# EAGLE design 74595 (EAGLE 9.6.2)
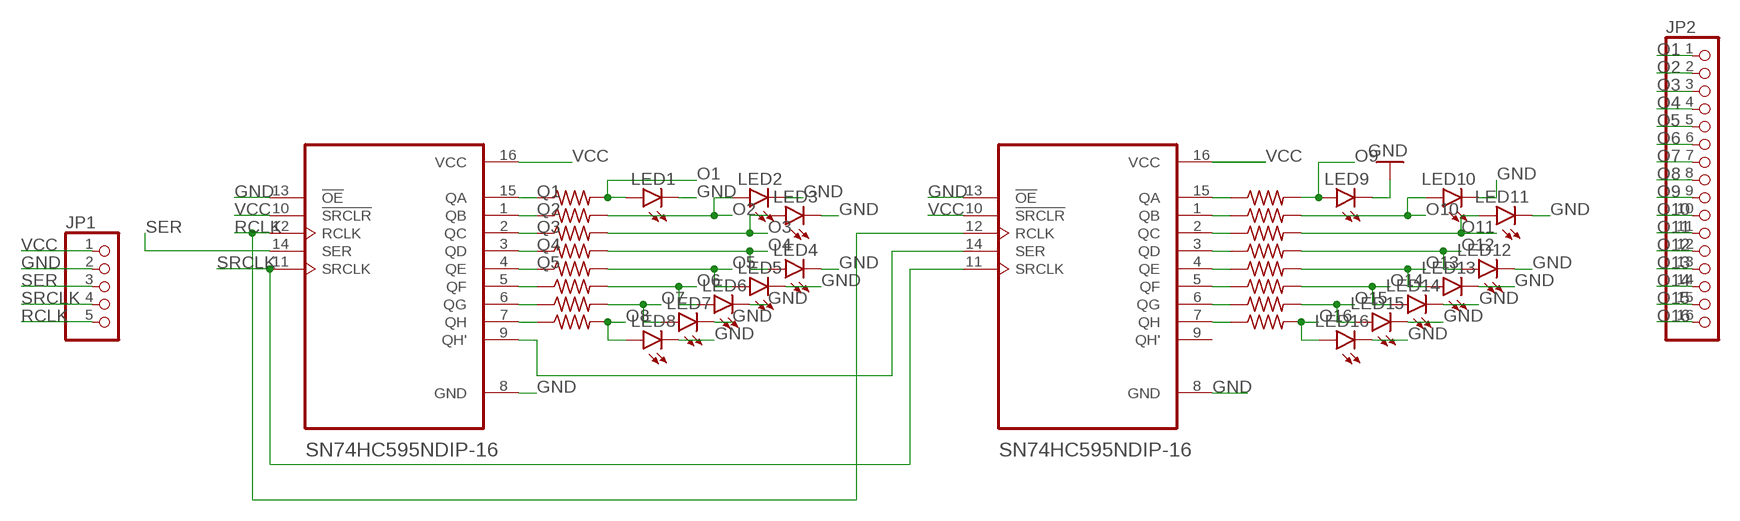
[diagram p0: schematic, sheet 1]

## Parts
JP1  PINHD-1X5  [1X05]
JP2  PINHD-1X16  [1X16]
LED1  LEDCHIPLED_0805  [CHIPLED_0805]
LED2  LEDCHIPLED_0805  [CHIPLED_0805]
LED3  LEDCHIPLED_0805  [CHIPLED_0805]
LED4  LEDCHIPLED_0805  [CHIPLED_0805]
LED5  LEDCHIPLED_0805  [CHIPLED_0805]
LED6  LEDCHIPLED_0805  [CHIPLED_0805]
LED7  LEDCHIPLED_0805  [CHIPLED_0805]
LED8  LEDCHIPLED_0805  [CHIPLED_0805]
LED9  LEDCHIPLED_0805  [CHIPLED_0805]
LED10  LEDCHIPLED_0805  [CHIPLED_0805]
LED11  LEDCHIPLED_0805  [CHIPLED_0805]
LED12  LEDCHIPLED_0805  [CHIPLED_0805]
LED13  LEDCHIPLED_0805  [CHIPLED_0805]
LED14  LEDCHIPLED_0805  [CHIPLED_0805]
LED15  LEDCHIPLED_0805  [CHIPLED_0805]
LED16  LEDCHIPLED_0805  [CHIPLED_0805]
R1  R-US_R0805  [R0805]
R2  R-US_R0805  [R0805]
R3  R-US_R0805  [R0805]
R4  R-US_R0805  [R0805]
R5  R-US_R0805  [R0805]
R6  R-US_R0805  [R0805]
R7  R-US_R0805  [R0805]
R8  R-US_R0805  [R0805]
R9  R-US_R0805  [R0805]
R10  R-US_R0805  [R0805]
R11  R-US_R0805  [R0805]
R12  R-US_R0805  [R0805]
R13  R-US_R0805  [R0805]
R14  R-US_R0805  [R0805]
R15  R-US_R0805  [R0805]
R16  R-US_R0805  [R0805]
U1  SN74HC595NDIP-16  [DIP794W45P254L1969H508Q16]
U2  SN74HC595NDIP-16  [DIP794W45P254L1969H508Q16]

## Nets
GND: JP1.2 LED1.C LED2.C LED3.C LED4.C LED5.C LED6.C LED7.C LED8.C LED9.C LED10.C LED11.C LED12.C LED13.C LED14.C LED15.C LED16.C U1.8(GND) U1.13(!OE) U2.8(GND) U2.13(!OE)
N$9: U1.9(QH') U2.14(SER)
O1: JP2.1 LED1.A R1.2
O2: JP2.2 LED2.A R2.2
O3: JP2.3 LED3.A R3.2
O4: JP2.4 LED4.A R4.2
O5: JP2.5 LED5.A R5.2
O6: JP2.6 LED6.A R6.2
O7: JP2.7 LED7.A R8.2
O8: JP2.8 LED8.A R9.2
O9: JP2.9 LED9.A R7.2
O10: JP2.10 LED10.A R10.2
O11: JP2.11 LED11.A R11.2
O12: JP2.12 LED12.A R12.2
O13: JP2.13 LED13.A R13.2
O14: JP2.14 LED14.A R14.2
O15: JP2.15 LED15.A R15.2
O16: JP2.16 LED16.A R16.2
Q1: R1.1 U1.15(QA)
Q2: R2.1 U1.1(QB)
Q3: R3.1 U1.2(QC)
Q4: R4.1 U1.3(QD)
Q5: R5.1 U1.4(QE)
Q6: R6.1 U1.5(QF)
Q7: R8.1 U1.6(QG)
Q8: R9.1 U1.7(QH)
Q9: R7.1 U2.15(QA)
Q10: R10.1 U2.1(QB)
Q11: R11.1 U2.2(QC)
Q12: R12.1 U2.3(QD)
Q13: R13.1 U2.4(QE)
Q14: R14.1 U2.5(QF)
Q15: R15.1 U2.6(QG)
Q16: R16.1 U2.7(QH)
RCLK: JP1.5 U1.12(RCLK) U2.12(RCLK)
SER: JP1.3 U1.14(SER)
SRCLK: JP1.4 U1.11(SRCLK) U2.11(SRCLK)
VCC: JP1.1 U1.10(!SRCLR) U1.16(VCC) U2.10(!SRCLR) U2.16(VCC)
Unconnected: U2.9(QH')

## Library data of the parts
JP1 = pinhead:PINHD-1X5: PIN HEADER
JP2 = pinhead:PINHD-1X16: PIN HEADER
LED1-LED16 = led:LED: LED OSRAM: - CHIPLED LG R971, LG N971, LY N971, LG Q971, LY Q971, LO R971, LY R971 LH N974, LH R974 LS Q976, LO Q976, LY Q976 LO Q996 - Hyper CHIPLED LW Q18S LB Q993, LB Q99A, LB R99A - SideLED LS A670, LO A670, LY A670, LG A670, LP A670 LB A673, LV A673, LT A673, LW A673 LH A674 LY A675 LS A676, LA A676, LO A676, LY A676, LW A676 LS A679, LY A679, LG A679 - Hyper Micro SIDELED® LS Y876, LA Y876, LO Y876, LY Y876 LT Y87S - SmartLED LW L88C, LW L88S LB L89C, LB L89S, LG L890 LS L89K, LO L89K, LY L89K LS L896, LA L896, LO L896, LY L896 - TOPLED LS T670, LO T670, LY T670, LG T670, LP T670 LSG T670, LSP T670, LSY T670, LOP T670, LYG T670 LG T671, LOG T671, LSG T671 LB T673, LV T673, LT T673, LW T673 LH T674 LS T676, LA T676, LO T676, LY T676, LB T676, LH T676, LSB T676, LW T676 LB T67C, LV T67C, LT T67C, LS T67K, LO T67K, LY T67K, LW E67C LS E67B, LA E67B, LO E67B, LY E67B, LB E67C, LV E67C, LT E67C LW T67C LS T679, LY T679, LG T679 LS T770, LO T770, LY T770, LG T770, LP T770 LB T773, LV T773, LT T773, LW T773 LH T774 LS E675, LA E675, LY E675, LS T675 LS T776, LA T776, LO T776, LY T776, LB T776 LHGB T686 LT T68C, LB T68C - Hyper Mini TOPLED® LB M676 - Mini TOPLED Santana® LG M470 LS M47K, LO M47K, LY M47K Source: http://www.osram.convergy.de LUXEON: - LUMILED® LXK2-PW12-R00, LXK2-PW12-S00, LXK2-PW14-U00, LXK2-PW14-V00 LXK2-PM12-R00, LXK2-PM12-S00, LXK2-PM14-U00 LXK2-PE12-Q00, LXK2-PE12-R00, LXK2-PE12-S00, LXK2-PE14-T00, LXK2-PE14-U00 LXK2-PB12-K00, LXK2-PB12-L00, LXK2-PB12-M00, LXK2-PB14-N00, LXK2-PB14-P00, LXK2-PB14-Q00 LXK2-PR12-L00, LXK2-PR12-M00, LXK2-PR14-Q00, LXK2-PR14-R00 LXK2-PD12-Q00, LXK2-PD12-R00, LXK2-PD12-S00 LXK2-PH12-R00, LXK2-PH12-S00 LXK2-PL12-P00, LXK2-PL12-Q00, LXK2-PL12-R00 Source: www.luxeon.com KINGBRIGHT: KA-3528ASYC Source: www.kingbright.com
R1-R16 = rcl:R-US_: RESISTOR, American symbol; SPICEPREFIX: R
U1 U2 = SN74HC595N:SN74HC595N: Check availability <https://pricing.snapeda.com/parts/SN74HC595N/Texas%20Instruments/view-part?ref=eda>; AVAILABILITY: In Stock; DESCRIPTION: 8-bit shift registers with 3-state output registers; MF: Texas Instruments; MP: SN74HC595N; PACKAGE: PDIP-16 Texas Instruments; PRICE: None; PURCHASE-URL: https://pricing.snapeda.com/search/part/SN74HC595N/?ref=eda

## Board
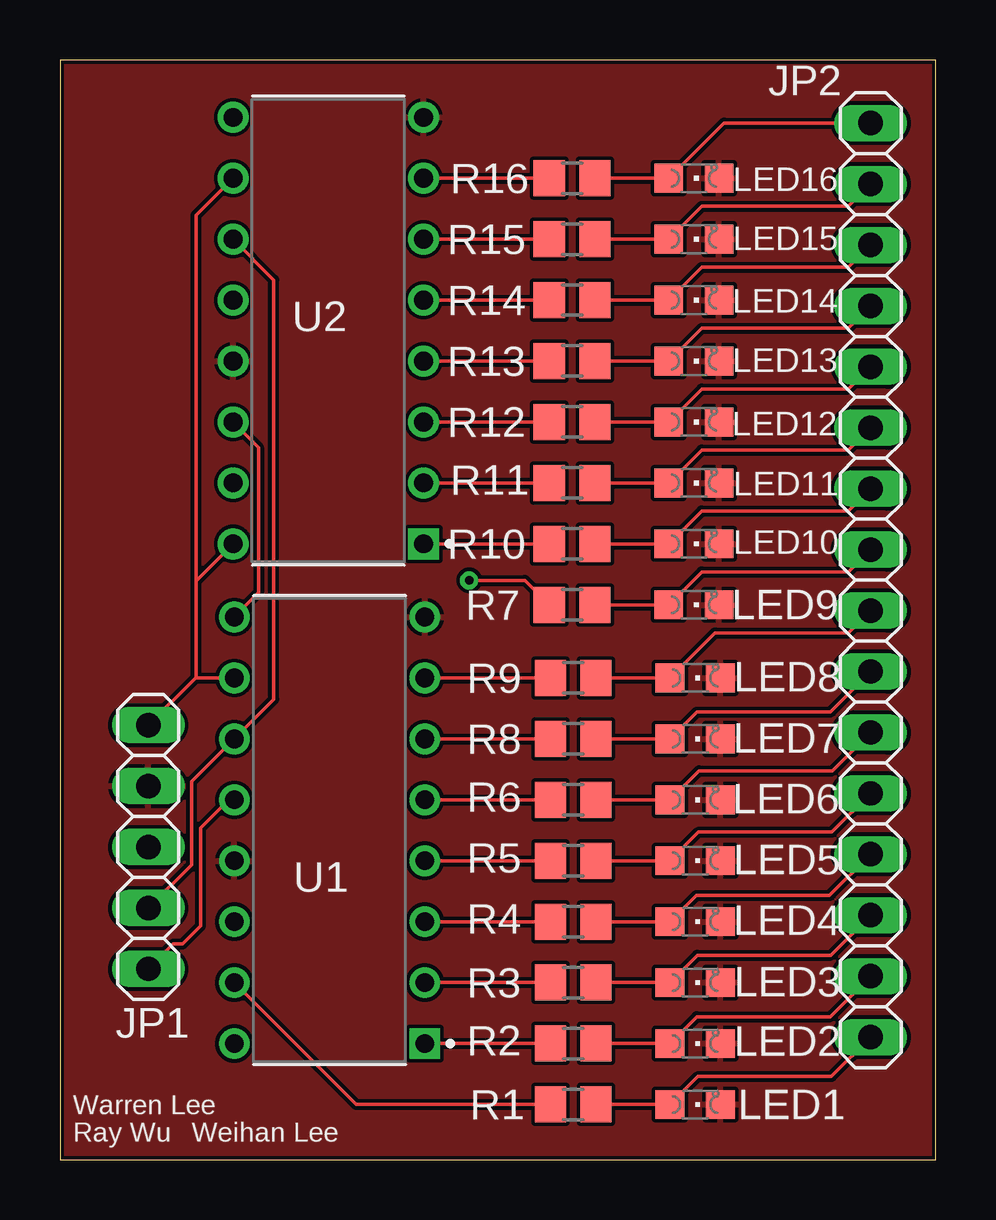
[diagram p1: board, top side]
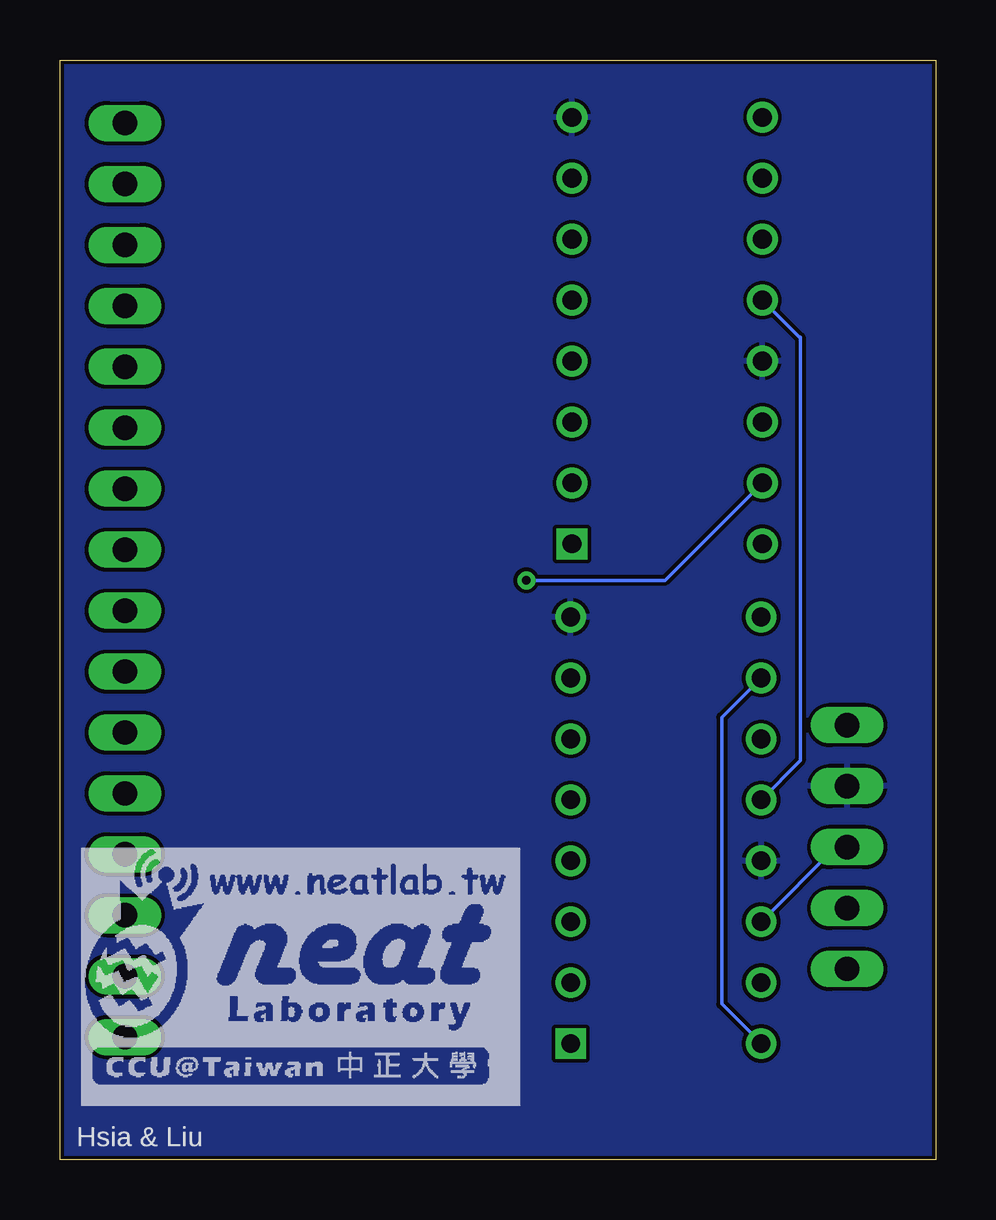
[diagram p2: board, bottom side, seen from below]

Size 36.5 x 45.84 mm. Coordinates in mm from the lower left corner, seen from the top.
Outline: 0,0 36.5,0 36.5,45.84 0,45.84 0,0
Copper layers (1*16): Top 0.035mm / dielectric 1.5mm / Bottom 0.035mm
Design rules "default1": minimum track width 6mil, minimum drill 0.3mm, track to track 6mil, track to pad 6mil, pad to pad 6mil, via to via 6mil, smd to smd 6mil, copper to edge 6mil, drill to drill 6mil, minimum pad ring 10mil, minimum via ring 8mil, stop-mask expansion 4mil, vias tented up to drill 0mil, thermal gap 6mil

### Footprints (pad centres in the part's own frame; a part is rotated, then mirrored left to right if it is on the bottom)
1X05 = drill 1.016 long: 1 -5.08,0; 2 -2.54,0; 3 0,0; 4 2.54,0; 5 5.08,0
1X16 = drill 1.016 long: 1 -19.05,0; 2 -16.51,0; 3 -13.97,0; 4 -11.43,0; 5 -8.89,0; 6 -6.35,0; 7 -3.81,0; 8 -1.27,0; 9 1.27,0; 10 3.81,0; 11 6.35,0; 12 8.89,0; 13 11.43,0; 14 13.97,0; 15 16.51,0; 16 19.05,0
CHIPLED_0805 = smd 1.2 x 1.2: A 0,-1.05; C 0,1.05
R0805 = smd 1.3 x 1.5: 1 -0.95,0; 2 0.95,0
DIP794W45P254L1969H508Q16 = drill 0.78 pad 1.13 square: 1 -3.97,8.89 | drill 0.78 pad 1.13: 2 -3.97,6.35; 3 -3.97,3.81; 4 -3.97,1.27; 5 -3.97,-1.27; 6 -3.97,-3.81; 7 -3.97,-6.35; 8 -3.97,-8.89; 9 3.97,-8.89; 10 3.97,-6.35; 11 3.97,-3.81; 12 3.97,-1.27; 13 3.97,1.27; 14 3.97,3.81; 15 3.97,6.35; 16 3.97,8.89

### Placement (x,y rotation side)
JP1  3.68,13.03 270 top
JP2  33.79,24.16 90 top
LED1  26.48,2.3 270 top
LED2  26.48,4.84 270 top
LED3  26.48,7.38 270 top
LED4  26.48,9.92 270 top
LED5  26.48,12.46 270 top
LED6  26.48,15 270 top
LED7  26.48,17.54 270 top
LED8  26.48,20.08 270 top
LED9  26.43,23.13 270 top
LED10  26.43,25.67 270 top
LED11  26.43,28.21 270 top
LED12  26.43,30.75 270 top
LED13  26.43,33.29 270 top
LED14  26.43,35.83 270 top
LED15  26.43,38.37 270 top
LED16  26.43,40.91 270 top
R1  21.4,2.3 0 top
R2  21.4,4.84 0 top
R3  21.4,7.38 0 top
R4  21.4,9.92 0 top
R5  21.4,12.46 0 top
R6  21.4,15 0 top
R7  21.35,23.13 0 top
R8  21.4,17.54 0 top
R9  21.4,20.08 0 top
R10  21.35,25.67 0 top
R11  21.35,28.21 0 top
R12  21.35,30.75 0 top
R13  21.35,33.29 0 top
R14  21.35,35.83 0 top
R15  21.35,38.37 0 top
R16  21.35,40.91 0 top
U1  11.24,13.73 180 top
U2  11.19,34.56 180 top
U$1  [LOGO_SCALE_1.8]  35.59,2.27 0 bottom

### Tracks (layer width: path | path; a pad name or v marks a point on that pad's centre or on a via)
GND
  pour Bottom: -0.23,46.09 -0.23,-0.39 36.73,-0.39 36.73,46.09
  pour Top: -0.61,46.47 37.11,46.47 37.11,-0.77 -0.61,-0.77
N$9
  Top 0.152: U2.14 8.28,29.69 8.28,23.63 U1.9
O1
  Top 0.152: R1.2 LED1.A 26.6,3.47 32.16,3.47 JP2.1
O2
  Top 0.152: R2.2 LED2.A 26.55,5.96 32.11,5.96 JP2.2
O3
  Top 0.152: R3.2 LED3.A 26.57,8.52 32.13,8.52 JP2.3
O4
  Top 0.152: R4.2 LED4.A 26.52,11.01 32.08,11.01 JP2.4
O5
  Top 0.152: R5.2 LED5.A 26.62,13.65 32.18,13.65 JP2.5
O6
  Top 0.152: R6.2 LED6.A 26.64,16.21 32.19,16.21 JP2.6
O7
  Top 0.152: R8.2 LED7.A 26.55,18.66 32.11,18.66 JP2.7
O8
  Top 0.152: R9.2 LED8.A 27.31,21.96 32.87,21.96 JP2.8
O9
  Top 0.152: R7.2 LED9.A 26.75,24.5 32.87,24.5 JP2.9
O10
  Top 0.152: R10.2 LED10.A 26.75,27.04 32.87,27.04 JP2.10
O11
  Top 0.152: R11.2 LED11.A 26.75,29.58 32.87,29.58 JP2.11
O12
  Top 0.152: R12.2 LED12.A 26.75,32.12 32.87,32.12 JP2.12
O13
  Top 0.152: R13.2 LED13.A 26.75,34.66 32.87,34.66 JP2.13
O14
  Top 0.152: R14.2 LED14.A 26.75,37.2 32.87,37.2 JP2.14
O15
  Top 0.152: R15.2 LED15.A 26.75,39.74 32.87,39.74 JP2.15
O16
  Top 0.152: R16.2 LED16.A 27.68,43.21 JP2.16
Q1
  Top 0.152: U1.15 12.35,2.3 R1.1
Q2
  Top 0.152: U1.1 R2.1
Q3
  Top 0.152: U1.2 R3.1
Q4
  Top 0.152: U1.3 R4.1
Q5
  Top 0.152: U1.4 R5.1
Q6
  Top 0.152: U1.5 R6.1
Q7
  Top 0.152: U1.6 R8.1
Q8
  Top 0.152: U1.7 R9.1
Q9  (via drill 0.35)
  Top 0.152: v17.06,24.14 19.38,24.14 R7.1
  Bottom 0.152: v17.06,24.14 11.28,24.14 U2.15
Q10
  Top 0.152: U2.1 R10.1
Q11
  Top 0.152: U2.2 R11.1
Q12
  Top 0.152: U2.3 R12.1
Q13
  Top 0.152: U2.4 R13.1
Q14
  Top 0.152: U2.5 R14.1
Q15
  Top 0.152: U2.6 R15.1
Q16
  Top 0.152: U2.7 R16.1
RCLK
  Top 0.152: JP1.5 4.72,8.99 5.11,8.99 5.85,9.74 5.85,13.83 7.02,15 U1.12
  Bottom 0.152: U2.12 5.67,34.28 5.64,34.28 5.64,16.63 U1.12
SER
  Bottom 0.152: JP1.3 4.16,13.03 U1.14
SRCLK
  Top 0.152: JP1.4 5.49,12.29 5.49,15.77 7.25,17.54 U1.11 8.92,19.18 8.92,36.67 U2.11
VCC
  Top 0.152: JP1.1 5.65,20.08 | 5.65,20.08 U1.10 | 5.65,20.08 5.68,20.1 5.68,24.13 | U2.16 5.68,24.13 | 5.68,24.13 5.68,39.37 U2.10
  Bottom 0.152: U1.10 8.92,18.43 8.92,6.48 U1.16

### Text on the board
tNames: Warren Lee | Ray Wu | Weihan Lee
bNames: Hsia & Liu